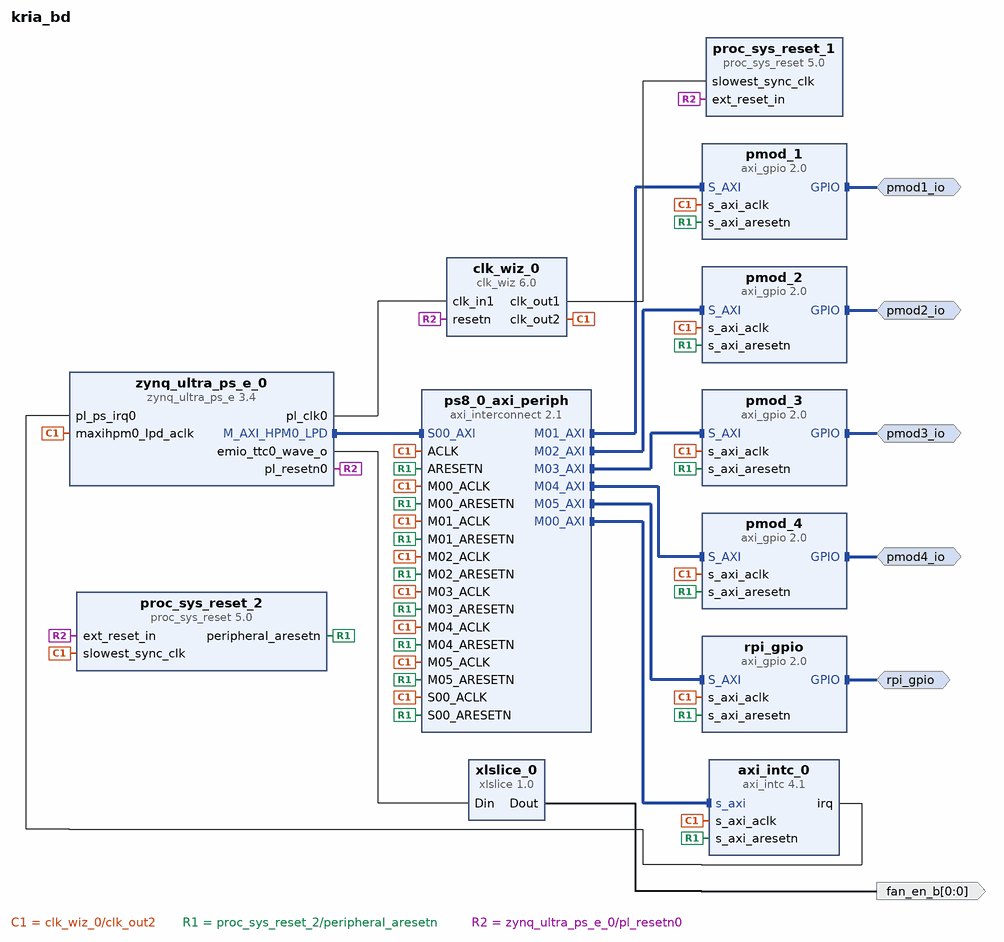
[diagram p0: block diagram of the top level]
# Vivado block design kria_bd, xck26-sfvc784-2LV-c, Vivado 2022.1
create_bd_design kria_bd

create_bd_intf_port -mode Master -vlnv xilinx.com:interface:gpio_rtl:1.0 pmod1_io
create_bd_intf_port -mode Master -vlnv xilinx.com:interface:gpio_rtl:1.0 pmod2_io
create_bd_intf_port -mode Master -vlnv xilinx.com:interface:gpio_rtl:1.0 pmod3_io
create_bd_intf_port -mode Master -vlnv xilinx.com:interface:gpio_rtl:1.0 pmod4_io
create_bd_intf_port -mode Master -vlnv xilinx.com:interface:gpio_rtl:1.0 rpi_gpio
create_bd_port -dir O -from 0 -to 0 fan_en_b

create_bd_cell -type ip -vlnv xilinx.com:ip:zynq_ultra_ps_e:3.4 zynq_ultra_ps_e_0
set_property -dict [list \
  CONFIG.PSU_BANK_0_IO_STANDARD LVCMOS18 \
  CONFIG.PSU_BANK_1_IO_STANDARD LVCMOS18 \
  CONFIG.PSU_BANK_2_IO_STANDARD LVCMOS18 \
  CONFIG.PSU_BANK_3_IO_STANDARD LVCMOS18 \
  CONFIG.PSU_USB3__DUAL_CLOCK_ENABLE 1 \
  CONFIG.PSU__CRF_APB__ACPU_CTRL__FREQMHZ 1333.333 \
  CONFIG.PSU__CRF_APB__ACPU_CTRL__SRCSEL APLL \
  CONFIG.PSU__CRF_APB__APLL_CTRL__SRCSEL PSS_REF_CLK \
  CONFIG.PSU__CRF_APB__APLL_FRAC_CFG__ENABLED 1 \
  CONFIG.PSU__CRF_APB__DBG_FPD_CTRL__FREQMHZ 250 \
  CONFIG.PSU__CRF_APB__DBG_FPD_CTRL__SRCSEL IOPLL \
  CONFIG.PSU__CRF_APB__DBG_TRACE_CTRL__FREQMHZ 250 \
  CONFIG.PSU__CRF_APB__DBG_TRACE_CTRL__SRCSEL IOPLL \
  CONFIG.PSU__CRF_APB__DBG_TSTMP_CTRL__FREQMHZ 250 \
  CONFIG.PSU__CRF_APB__DBG_TSTMP_CTRL__SRCSEL IOPLL \
  CONFIG.PSU__CRF_APB__DDR_CTRL__FREQMHZ 1200 \
  CONFIG.PSU__CRF_APB__DDR_CTRL__SRCSEL DPLL \
  CONFIG.PSU__CRF_APB__DPDMA_REF_CTRL__FREQMHZ 600 \
  CONFIG.PSU__CRF_APB__DPDMA_REF_CTRL__SRCSEL APLL \
  CONFIG.PSU__CRF_APB__DPLL_CTRL__SRCSEL PSS_REF_CLK \
  CONFIG.PSU__CRF_APB__DP_AUDIO_REF_CTRL__SRCSEL RPLL \
  CONFIG.PSU__CRF_APB__DP_STC_REF_CTRL__SRCSEL RPLL \
  CONFIG.PSU__CRF_APB__DP_VIDEO_REF_CTRL__SRCSEL VPLL \
  CONFIG.PSU__CRF_APB__GDMA_REF_CTRL__FREQMHZ 600 \
  CONFIG.PSU__CRF_APB__GDMA_REF_CTRL__SRCSEL DPLL \
  CONFIG.PSU__CRF_APB__GPU_REF_CTRL__FREQMHZ 600 \
  CONFIG.PSU__CRF_APB__GPU_REF_CTRL__SRCSEL IOPLL \
  CONFIG.PSU__CRF_APB__TOPSW_LSBUS_CTRL__FREQMHZ 100 \
  CONFIG.PSU__CRF_APB__TOPSW_LSBUS_CTRL__SRCSEL IOPLL \
  CONFIG.PSU__CRF_APB__TOPSW_MAIN_CTRL__FREQMHZ 533.33 \
  CONFIG.PSU__CRF_APB__TOPSW_MAIN_CTRL__SRCSEL DPLL \
  CONFIG.PSU__CRF_APB__VPLL_CTRL__SRCSEL PSS_REF_CLK \
  CONFIG.PSU__CRL_APB__ADMA_REF_CTRL__FREQMHZ 500 \
  CONFIG.PSU__CRL_APB__ADMA_REF_CTRL__SRCSEL IOPLL \
  CONFIG.PSU__CRL_APB__CPU_R5_CTRL__FREQMHZ 533.333 \
  CONFIG.PSU__CRL_APB__CPU_R5_CTRL__SRCSEL RPLL \
  CONFIG.PSU__CRL_APB__DBG_LPD_CTRL__FREQMHZ 250 \
  CONFIG.PSU__CRL_APB__DBG_LPD_CTRL__SRCSEL IOPLL \
  CONFIG.PSU__CRL_APB__IOPLL_CTRL__SRCSEL PSS_REF_CLK \
  CONFIG.PSU__CRL_APB__IOU_SWITCH_CTRL__FREQMHZ 250 \
  CONFIG.PSU__CRL_APB__IOU_SWITCH_CTRL__SRCSEL IOPLL \
  CONFIG.PSU__CRL_APB__LPD_LSBUS_CTRL__FREQMHZ 100 \
  CONFIG.PSU__CRL_APB__LPD_LSBUS_CTRL__SRCSEL IOPLL \
  CONFIG.PSU__CRL_APB__LPD_SWITCH_CTRL__FREQMHZ 500 \
  CONFIG.PSU__CRL_APB__LPD_SWITCH_CTRL__SRCSEL IOPLL \
  CONFIG.PSU__CRL_APB__PCAP_CTRL__FREQMHZ 200 \
  CONFIG.PSU__CRL_APB__PCAP_CTRL__SRCSEL IOPLL \
  CONFIG.PSU__CRL_APB__PL0_REF_CTRL__FREQMHZ 100 \
  CONFIG.PSU__CRL_APB__PL0_REF_CTRL__SRCSEL IOPLL \
  CONFIG.PSU__CRL_APB__PL1_REF_CTRL__SRCSEL IOPLL \
  CONFIG.PSU__CRL_APB__QSPI_REF_CTRL__FREQMHZ 125 \
  CONFIG.PSU__CRL_APB__QSPI_REF_CTRL__SRCSEL IOPLL \
  CONFIG.PSU__CRL_APB__RPLL_CTRL__SRCSEL PSS_REF_CLK \
  CONFIG.PSU__CRL_APB__SPI1_REF_CTRL__SRCSEL IOPLL \
  CONFIG.PSU__CRL_APB__TIMESTAMP_REF_CTRL__FREQMHZ 100 \
  CONFIG.PSU__CRL_APB__TIMESTAMP_REF_CTRL__SRCSEL IOPLL \
  CONFIG.PSU__CRL_APB__USB3__ENABLE 1 \
  CONFIG.PSU__CSUPMU__PERIPHERAL__VALID 1 \
  CONFIG.PSU__DDRC__BUS_WIDTH {64 Bit} \
  CONFIG.PSU__DDRC__COMPONENTS Components \
  CONFIG.PSU__DDRC__DEVICE_CAPACITY {8192 MBits} \
  CONFIG.PSU__DDRC__DRAM_WIDTH {16 Bits} \
  CONFIG.PSU__DDRC__ECC Disabled \
  CONFIG.PSU__DDRC__MEMORY_TYPE {DDR 4} \
  CONFIG.PSU__DDRC__SPEED_BIN DDR4_2400R \
  CONFIG.PSU__DDR_HIGH_ADDRESS_GUI_ENABLE 1 \
  CONFIG.PSU__DDR__INTERFACE__FREQMHZ 600.000 \
  CONFIG.PSU__DISPLAYPORT__LANE0__ENABLE 1 \
  CONFIG.PSU__DISPLAYPORT__LANE0__IO {GT Lane1} \
  CONFIG.PSU__DISPLAYPORT__LANE1__ENABLE 0 \
  CONFIG.PSU__DISPLAYPORT__PERIPHERAL__ENABLE 1 \
  CONFIG.PSU__DPAUX__PERIPHERAL__ENABLE 1 \
  CONFIG.PSU__DPAUX__PERIPHERAL__IO {MIO 27 .. 30} \
  CONFIG.PSU__DP__LANE_SEL {Single Lower} \
  CONFIG.PSU__DP__REF_CLK_FREQ 27 \
  CONFIG.PSU__DP__REF_CLK_SEL {Ref Clk2} \
  CONFIG.PSU__ENET0__PERIPHERAL__ENABLE 1 \
  CONFIG.PSU__ENET0__PERIPHERAL__IO {GT Lane0} \
  CONFIG.PSU__ENET1__GRP_MDIO__ENABLE 1 \
  CONFIG.PSU__ENET1__GRP_MDIO__IO {MIO 50 .. 51} \
  CONFIG.PSU__ENET1__PERIPHERAL__ENABLE 1 \
  CONFIG.PSU__ENET1__PERIPHERAL__IO {MIO 38 .. 49} \
  CONFIG.PSU__FPGA_PL0_ENABLE 1 \
  CONFIG.PSU__FPGA_PL1_ENABLE 1 \
  CONFIG.PSU__GEM0__REF_CLK_FREQ 125 \
  CONFIG.PSU__GEM0__REF_CLK_SEL {Ref Clk1} \
  CONFIG.PSU__GEM__TSU__ENABLE 0 \
  CONFIG.PSU__GPIO0_MIO__IO {MIO 0 .. 25} \
  CONFIG.PSU__GPIO0_MIO__PERIPHERAL__ENABLE 1 \
  CONFIG.PSU__GPIO1_MIO__IO {MIO 26 .. 51} \
  CONFIG.PSU__GPIO1_MIO__PERIPHERAL__ENABLE 1 \
  CONFIG.PSU__GPIO_EMIO__WIDTH {[91:0]} \
  CONFIG.PSU__GT__LINK_SPEED HBR \
  CONFIG.PSU__GT__PRE_EMPH_LVL_4 0 \
  CONFIG.PSU__GT__VLT_SWNG_LVL_4 0 \
  CONFIG.PSU__I2C1__PERIPHERAL__ENABLE 1 \
  CONFIG.PSU__I2C1__PERIPHERAL__IO {MIO 24 .. 25} \
  CONFIG.PSU__IOU_SLCR__IOU_TTC_APB_CLK__TTC0_SEL APB \
  CONFIG.PSU__IOU_SLCR__IOU_TTC_APB_CLK__TTC1_SEL APB \
  CONFIG.PSU__IOU_SLCR__IOU_TTC_APB_CLK__TTC2_SEL APB \
  CONFIG.PSU__IOU_SLCR__IOU_TTC_APB_CLK__TTC3_SEL APB \
  CONFIG.PSU__NUM_FABRIC_RESETS 4 \
  CONFIG.PSU__OVERRIDE__BASIC_CLOCK 0 \
  CONFIG.PSU__PMU_COHERENCY 0 \
  CONFIG.PSU__PMU__AIBACK__ENABLE 0 \
  CONFIG.PSU__PMU__EMIO_GPI__ENABLE 0 \
  CONFIG.PSU__PMU__EMIO_GPO__ENABLE 0 \
  CONFIG.PSU__PMU__GPI0__ENABLE 1 \
  CONFIG.PSU__PMU__GPI0__IO {MIO 26} \
  CONFIG.PSU__PMU__GPI1__ENABLE 0 \
  CONFIG.PSU__PMU__GPI2__ENABLE 0 \
  CONFIG.PSU__PMU__GPI3__ENABLE 0 \
  CONFIG.PSU__PMU__GPI4__ENABLE 0 \
  CONFIG.PSU__PMU__GPI5__ENABLE 1 \
  CONFIG.PSU__PMU__GPI5__IO {MIO 31} \
  CONFIG.PSU__PMU__GPO0__ENABLE 1 \
  CONFIG.PSU__PMU__GPO0__IO {MIO 32} \
  CONFIG.PSU__PMU__GPO1__ENABLE 1 \
  CONFIG.PSU__PMU__GPO1__IO {MIO 33} \
  CONFIG.PSU__PMU__GPO2__ENABLE 1 \
  CONFIG.PSU__PMU__GPO2__IO {MIO 34} \
  CONFIG.PSU__PMU__GPO2__POLARITY high \
  CONFIG.PSU__PMU__GPO3__ENABLE 1 \
  CONFIG.PSU__PMU__GPO3__IO {MIO 35} \
  CONFIG.PSU__PMU__GPO3__POLARITY low \
  CONFIG.PSU__PMU__GPO4__ENABLE 0 \
  CONFIG.PSU__PMU__GPO5__ENABLE 0 \
  CONFIG.PSU__PMU__PERIPHERAL__ENABLE 1 \
  CONFIG.PSU__PMU__PLERROR__ENABLE 0 \
  CONFIG.PSU__PRESET_APPLIED 1 \
  CONFIG.PSU__PSS_REF_CLK__FREQMHZ 33.333 \
  CONFIG.PSU__QSPI_COHERENCY 0 \
  CONFIG.PSU__QSPI_ROUTE_THROUGH_FPD 0 \
  CONFIG.PSU__QSPI__GRP_FBCLK__ENABLE 0 \
  CONFIG.PSU__QSPI__PERIPHERAL__DATA_MODE x4 \
  CONFIG.PSU__QSPI__PERIPHERAL__ENABLE 1 \
  CONFIG.PSU__QSPI__PERIPHERAL__IO {MIO 0 .. 5} \
  CONFIG.PSU__QSPI__PERIPHERAL__MODE Single \
  CONFIG.PSU__SPI1__GRP_SS0__IO {MIO 9} \
  CONFIG.PSU__SPI1__PERIPHERAL__ENABLE 1 \
  CONFIG.PSU__SPI1__PERIPHERAL__IO {MIO 6 .. 11} \
  CONFIG.PSU__SWDT0__CLOCK__ENABLE 0 \
  CONFIG.PSU__SWDT0__PERIPHERAL__ENABLE 1 \
  CONFIG.PSU__SWDT0__RESET__ENABLE 0 \
  CONFIG.PSU__SWDT1__CLOCK__ENABLE 0 \
  CONFIG.PSU__SWDT1__PERIPHERAL__ENABLE 1 \
  CONFIG.PSU__SWDT1__RESET__ENABLE 0 \
  CONFIG.PSU__TSU__BUFG_PORT_PAIR 0 \
  CONFIG.PSU__TTC0__CLOCK__ENABLE 0 \
  CONFIG.PSU__TTC0__PERIPHERAL__ENABLE 1 \
  CONFIG.PSU__TTC0__WAVEOUT__ENABLE 1 \
  CONFIG.PSU__TTC0__WAVEOUT__IO EMIO \
  CONFIG.PSU__TTC1__CLOCK__ENABLE 0 \
  CONFIG.PSU__TTC1__PERIPHERAL__ENABLE 1 \
  CONFIG.PSU__TTC1__WAVEOUT__ENABLE 0 \
  CONFIG.PSU__TTC2__CLOCK__ENABLE 0 \
  CONFIG.PSU__TTC2__PERIPHERAL__ENABLE 1 \
  CONFIG.PSU__TTC2__WAVEOUT__ENABLE 0 \
  CONFIG.PSU__TTC3__CLOCK__ENABLE 0 \
  CONFIG.PSU__TTC3__PERIPHERAL__ENABLE 1 \
  CONFIG.PSU__TTC3__WAVEOUT__ENABLE 0 \
  CONFIG.PSU__UART1__BAUD_RATE 115200 \
  CONFIG.PSU__UART1__MODEM__ENABLE 0 \
  CONFIG.PSU__UART1__PERIPHERAL__ENABLE 1 \
  CONFIG.PSU__UART1__PERIPHERAL__IO {MIO 36 .. 37} \
  CONFIG.PSU__USB0_COHERENCY 0 \
  CONFIG.PSU__USB0__PERIPHERAL__ENABLE 1 \
  CONFIG.PSU__USB0__PERIPHERAL__IO {MIO 52 .. 63} \
  CONFIG.PSU__USB0__REF_CLK_FREQ 26 \
  CONFIG.PSU__USB0__REF_CLK_SEL {Ref Clk3} \
  CONFIG.PSU__USB0__RESET__ENABLE 1 \
  CONFIG.PSU__USB0__RESET__IO {MIO 76} \
  CONFIG.PSU__USB1__PERIPHERAL__ENABLE 1 \
  CONFIG.PSU__USB1__PERIPHERAL__IO {MIO 64 .. 75} \
  CONFIG.PSU__USB1__REF_CLK_FREQ 26 \
  CONFIG.PSU__USB1__REF_CLK_SEL {Ref Clk3} \
  CONFIG.PSU__USB1__RESET__ENABLE 1 \
  CONFIG.PSU__USB1__RESET__IO {MIO 77} \
  CONFIG.PSU__USB2_0__EMIO__ENABLE 0 \
  CONFIG.PSU__USB3_0__EMIO__ENABLE 0 \
  CONFIG.PSU__USB3_0__PERIPHERAL__ENABLE 1 \
  CONFIG.PSU__USB3_0__PERIPHERAL__IO {GT Lane2} \
  CONFIG.PSU__USB3_1__PERIPHERAL__ENABLE 1 \
  CONFIG.PSU__USB3_1__PERIPHERAL__IO {GT Lane3} \
  CONFIG.PSU__USB__RESET__MODE {Separate MIO Pin} \
  CONFIG.PSU__USB__RESET__POLARITY {Active Low} \
  CONFIG.PSU__USE__IRQ0 1 \
  CONFIG.PSU__USE__M_AXI_GP0 0 \
  CONFIG.PSU__USE__M_AXI_GP1 0 \
  CONFIG.PSU__USE__M_AXI_GP2 1 \
] [get_bd_cells zynq_ultra_ps_e_0]
# 244 more settings of zynq_ultra_ps_e_0 are not shown: defaults, MIO pin electricals, DDR timing, and values the tool derives
create_bd_cell -type ip -vlnv xilinx.com:ip:clk_wiz:6.0 clk_wiz_0
set_property -dict [list \
  CONFIG.CLKOUT2_JITTER 102.087 \
  CONFIG.CLKOUT2_PHASE_ERROR 87.181 \
  CONFIG.CLKOUT2_REQUESTED_OUT_FREQ 200.000 \
  CONFIG.CLKOUT2_USED true \
  CONFIG.MMCM_CLKOUT1_DIVIDE 6 \
  CONFIG.NUM_OUT_CLKS 2 \
  CONFIG.RESET_PORT resetn \
  CONFIG.RESET_TYPE ACTIVE_LOW \
] [get_bd_cells clk_wiz_0]
create_bd_cell -type ip -vlnv xilinx.com:ip:proc_sys_reset:5.0 proc_sys_reset_1
create_bd_cell -type ip -vlnv xilinx.com:ip:proc_sys_reset:5.0 proc_sys_reset_2
create_bd_cell -type ip -vlnv xilinx.com:ip:axi_intc:4.1 axi_intc_0
set_property -dict {CONFIG.C_IRQ_CONNECTION 1} [get_bd_cells axi_intc_0]
create_bd_cell -type ip -vlnv xilinx.com:ip:axi_interconnect:2.1 ps8_0_axi_periph
set_property -dict {CONFIG.NUM_MI 6} [get_bd_cells ps8_0_axi_periph]
create_bd_cell -type ip -vlnv xilinx.com:ip:xlslice:1.0 xlslice_0
set_property -dict {CONFIG.DIN_FROM 2 CONFIG.DIN_TO 2 CONFIG.DIN_WIDTH 3 CONFIG.DOUT_WIDTH 1} [get_bd_cells xlslice_0]
create_bd_cell -type ip -vlnv xilinx.com:ip:axi_gpio:2.0 pmod_1
set_property -dict {CONFIG.C_GPIO_WIDTH 8} [get_bd_cells pmod_1]
create_bd_cell -type ip -vlnv xilinx.com:ip:axi_gpio:2.0 pmod_2
set_property -dict {CONFIG.C_GPIO_WIDTH 8} [get_bd_cells pmod_2]
create_bd_cell -type ip -vlnv xilinx.com:ip:axi_gpio:2.0 pmod_3
set_property -dict {CONFIG.C_GPIO_WIDTH 8} [get_bd_cells pmod_3]
create_bd_cell -type ip -vlnv xilinx.com:ip:axi_gpio:2.0 pmod_4
set_property -dict {CONFIG.C_GPIO_WIDTH 8} [get_bd_cells pmod_4]
create_bd_cell -type ip -vlnv xilinx.com:ip:axi_gpio:2.0 rpi_gpio
set_property -dict {CONFIG.C_GPIO_WIDTH 28} [get_bd_cells rpi_gpio]

# ---- connections ----

connect_bd_intf_net [get_bd_intf_ports pmod1_io] [get_bd_intf_pins pmod_1/GPIO]
connect_bd_intf_net [get_bd_intf_ports pmod2_io] [get_bd_intf_pins pmod_2/GPIO]
connect_bd_intf_net [get_bd_intf_ports pmod3_io] [get_bd_intf_pins pmod_3/GPIO]
connect_bd_intf_net [get_bd_intf_ports pmod4_io] [get_bd_intf_pins pmod_4/GPIO]
connect_bd_intf_net [get_bd_intf_pins ps8_0_axi_periph/M00_AXI] [get_bd_intf_pins axi_intc_0/s_axi]
connect_bd_intf_net [get_bd_intf_pins ps8_0_axi_periph/M01_AXI] [get_bd_intf_pins pmod_1/S_AXI]
connect_bd_intf_net [get_bd_intf_pins ps8_0_axi_periph/M02_AXI] [get_bd_intf_pins pmod_2/S_AXI]
connect_bd_intf_net [get_bd_intf_pins ps8_0_axi_periph/M03_AXI] [get_bd_intf_pins pmod_3/S_AXI]
connect_bd_intf_net [get_bd_intf_pins ps8_0_axi_periph/M04_AXI] [get_bd_intf_pins pmod_4/S_AXI]
connect_bd_intf_net [get_bd_intf_pins ps8_0_axi_periph/M05_AXI] [get_bd_intf_pins rpi_gpio/S_AXI]
connect_bd_intf_net [get_bd_intf_ports rpi_gpio] [get_bd_intf_pins rpi_gpio/GPIO]
connect_bd_intf_net [get_bd_intf_pins zynq_ultra_ps_e_0/M_AXI_HPM0_LPD] [get_bd_intf_pins ps8_0_axi_periph/S00_AXI]
connect_bd_net [get_bd_pins axi_intc_0/irq] [get_bd_pins zynq_ultra_ps_e_0/pl_ps_irq0]
connect_bd_net [get_bd_pins clk_wiz_0/clk_out1] [get_bd_pins proc_sys_reset_1/slowest_sync_clk]
connect_bd_net [get_bd_pins clk_wiz_0/clk_out2] \
  [get_bd_pins proc_sys_reset_2/slowest_sync_clk] [get_bd_pins ps8_0_axi_periph/ACLK] \
  [get_bd_pins zynq_ultra_ps_e_0/maxihpm0_lpd_aclk] [get_bd_pins ps8_0_axi_periph/S00_ACLK] \
  [get_bd_pins axi_intc_0/s_axi_aclk] [get_bd_pins ps8_0_axi_periph/M00_ACLK] [get_bd_pins pmod_1/s_axi_aclk] \
  [get_bd_pins ps8_0_axi_periph/M01_ACLK] [get_bd_pins pmod_2/s_axi_aclk] [get_bd_pins ps8_0_axi_periph/M02_ACLK] \
  [get_bd_pins pmod_3/s_axi_aclk] [get_bd_pins ps8_0_axi_periph/M03_ACLK] [get_bd_pins pmod_4/s_axi_aclk] \
  [get_bd_pins ps8_0_axi_periph/M04_ACLK] [get_bd_pins rpi_gpio/s_axi_aclk] [get_bd_pins ps8_0_axi_periph/M05_ACLK]
connect_bd_net [get_bd_pins proc_sys_reset_2/peripheral_aresetn] \
  [get_bd_pins ps8_0_axi_periph/S00_ARESETN] [get_bd_pins axi_intc_0/s_axi_aresetn] \
  [get_bd_pins ps8_0_axi_periph/M00_ARESETN] [get_bd_pins ps8_0_axi_periph/ARESETN] [get_bd_pins pmod_1/s_axi_aresetn] \
  [get_bd_pins ps8_0_axi_periph/M01_ARESETN] [get_bd_pins pmod_2/s_axi_aresetn] [get_bd_pins ps8_0_axi_periph/M02_ARESETN] \
  [get_bd_pins pmod_3/s_axi_aresetn] [get_bd_pins ps8_0_axi_periph/M03_ARESETN] [get_bd_pins pmod_4/s_axi_aresetn] \
  [get_bd_pins ps8_0_axi_periph/M04_ARESETN] [get_bd_pins rpi_gpio/s_axi_aresetn] [get_bd_pins ps8_0_axi_periph/M05_ARESETN]
connect_bd_net [get_bd_pins xlslice_0/Dout] [get_bd_ports fan_en_b]
connect_bd_net [get_bd_pins zynq_ultra_ps_e_0/emio_ttc0_wave_o] [get_bd_pins xlslice_0/Din]
connect_bd_net [get_bd_pins zynq_ultra_ps_e_0/pl_clk0] [get_bd_pins clk_wiz_0/clk_in1]
connect_bd_net [get_bd_pins zynq_ultra_ps_e_0/pl_resetn0] \
  [get_bd_pins clk_wiz_0/resetn] [get_bd_pins proc_sys_reset_1/ext_reset_in] [get_bd_pins proc_sys_reset_2/ext_reset_in]
set_property PFM.AXI_PORT {M_AXI_HPM0_FPD {memport "M_AXI_GP" sptag "" memory "" is_range "false"} M_AXI_HPM1_FPD {memport "M_AXI_GP" sptag "" memory "" is_range "false"} S_AXI_HPC0_FPD {memport "S_AXI_HPC" sptag "HPC0" memory "" is_range "false"} S_AXI_HPC1_FPD {memport "S_AXI_HPC" sptag "HPC1" memory "" is_range "false"} S_AXI_HP0_FPD {memport "S_AXI_HP" sptag "HP0" memory "" is_range "false"} S_AXI_HP1_FPD {memport "S_AXI_HP" sptag "HP1" memory "" is_range "false"} S_AXI_HP2_FPD {memport "S_AXI_HP" sptag "HP2" memory "" is_range "false"} S_AXI_HP3_FPD {memport "S_AXI_HP" sptag "HP3" memory "" is_range "false"}} [get_bd_cells zynq_ultra_ps_e_0]
set_property PFM.CLOCK {clk_out1 {id "0" is_default "false" proc_sys_reset "/proc_sys_reset_1" status "fixed" freq_hz "100000000"} clk_out2 {id "1" is_default "true" proc_sys_reset "/proc_sys_reset_2" status "fixed" freq_hz "200000000"}} [get_bd_cells clk_wiz_0]
set_property PFM.IRQ {intr { id 0 range 32 }} [get_bd_cells axi_intc_0]
set_property PFM.AXI_PORT {M06_AXI { memport "M_AXI_GP" sptag "" memory "" is_range "false" } M07_AXI { memport "M_AXI_GP" sptag "" memory "" is_range "false" } M08_AXI { memport "M_AXI_GP" sptag "" memory "" is_range "false" } } [get_bd_cells ps8_0_axi_periph]

# ---- address map ----
assign_bd_address -offset 0x0080000000 -range 64K -target_address_space [get_bd_addr_spaces zynq_ultra_ps_e_0/Data] [get_bd_addr_segs axi_intc_0/S_AXI/Reg]
assign_bd_address -offset 0x0080010000 -range 64K -target_address_space [get_bd_addr_spaces zynq_ultra_ps_e_0/Data] [get_bd_addr_segs pmod_1/S_AXI/Reg]
assign_bd_address -offset 0x0080020000 -range 64K -target_address_space [get_bd_addr_spaces zynq_ultra_ps_e_0/Data] [get_bd_addr_segs pmod_2/S_AXI/Reg]
assign_bd_address -offset 0x0080030000 -range 64K -target_address_space [get_bd_addr_spaces zynq_ultra_ps_e_0/Data] [get_bd_addr_segs pmod_3/S_AXI/Reg]
assign_bd_address -offset 0x0080040000 -range 64K -target_address_space [get_bd_addr_spaces zynq_ultra_ps_e_0/Data] [get_bd_addr_segs pmod_4/S_AXI/Reg]
assign_bd_address -offset 0x0080050000 -range 64K -target_address_space [get_bd_addr_spaces zynq_ultra_ps_e_0/Data] [get_bd_addr_segs rpi_gpio/S_AXI/Reg]

validate_bd_design
save_bd_design
